# EAGLE design main (EAGLE 5.12)

## Sheet 1 of 4
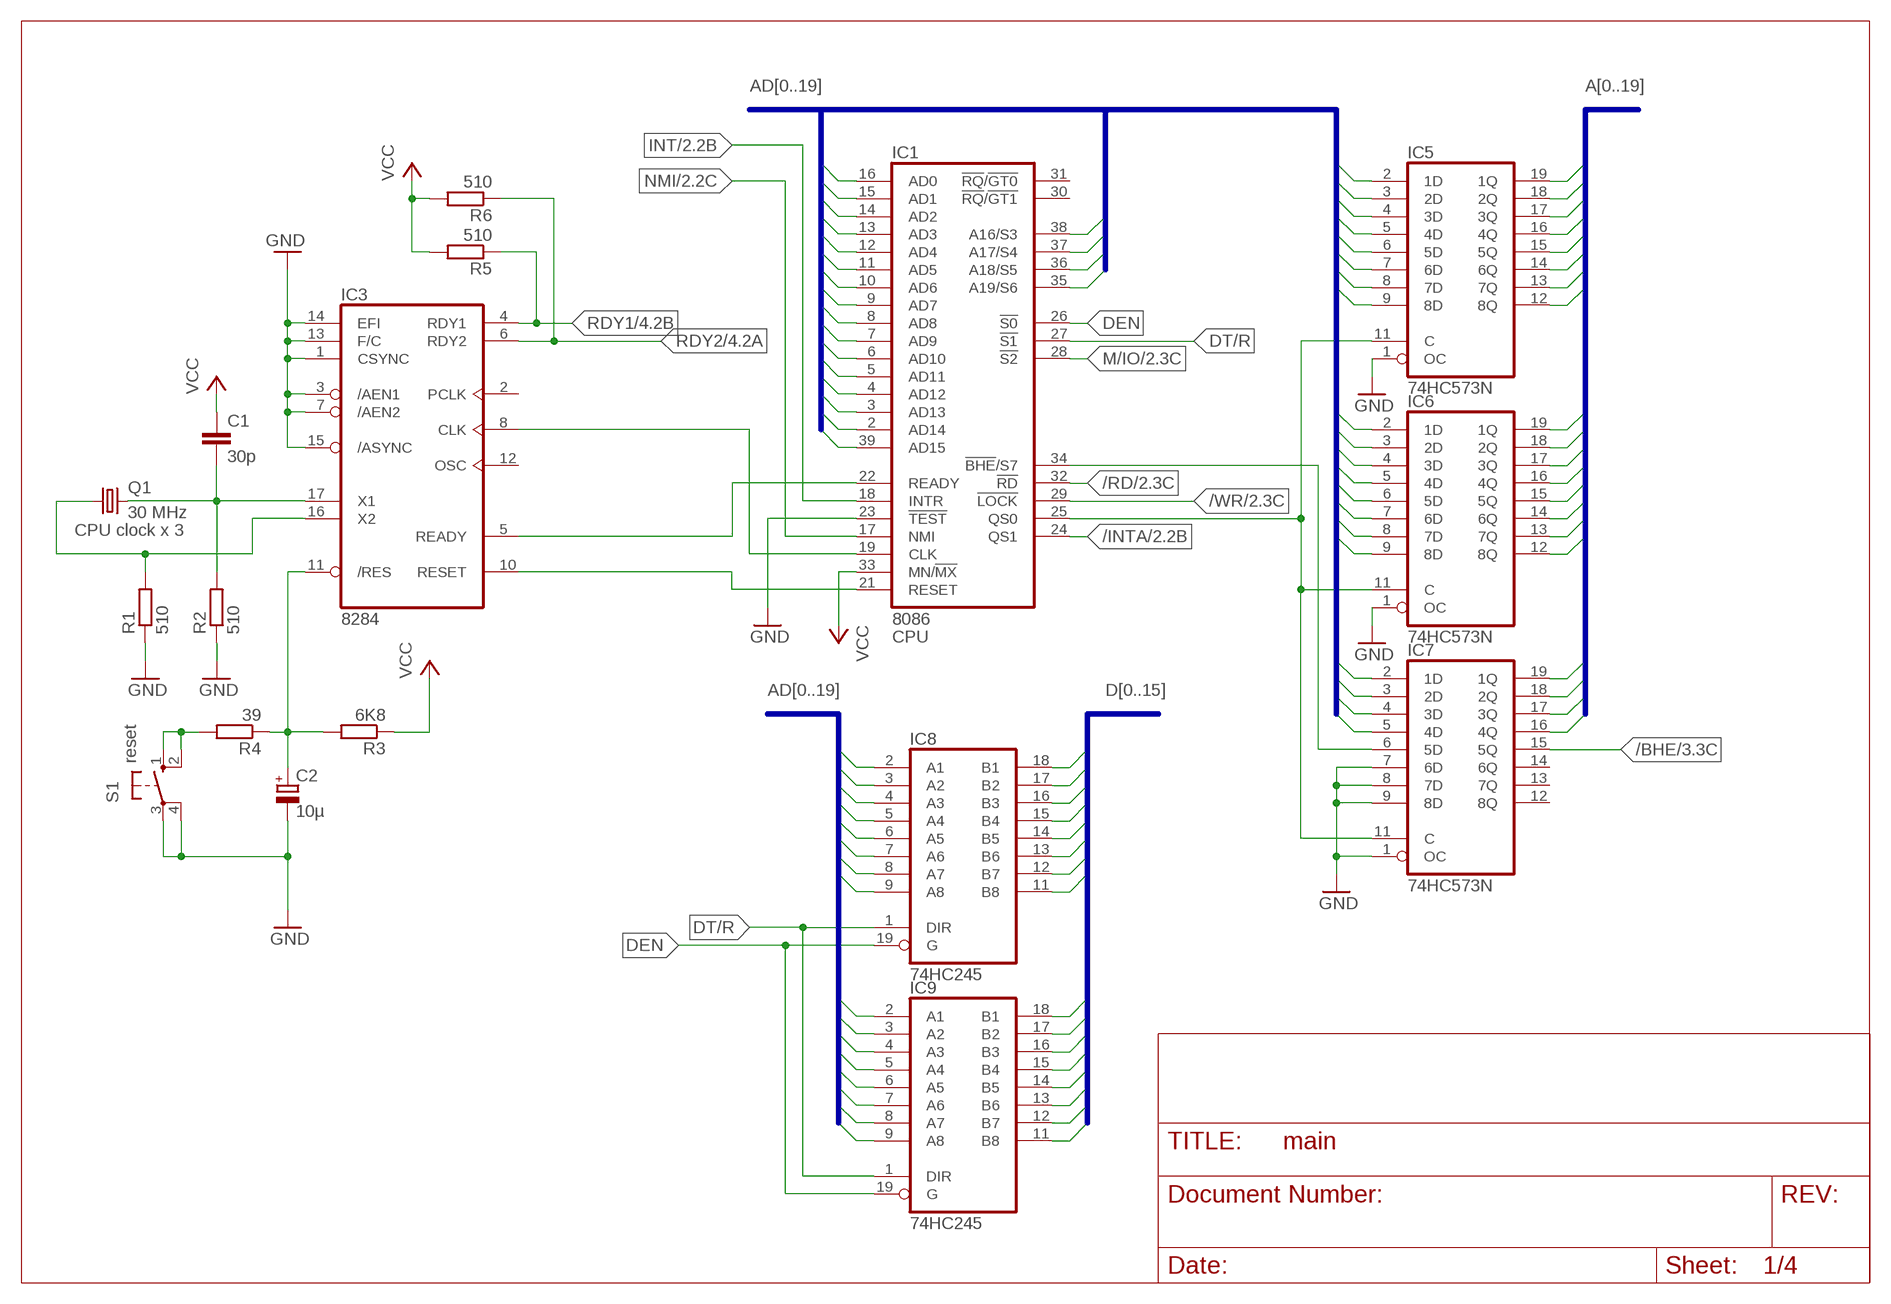
[diagram p0: schematic, sheet 1]

### Parts
C1  30p  C-EU025-024X044  [C025-024X044]
C2  10µ  CPOL-EUE2-4  [E2-4]
IC1  8086  [DIL40]
IC3  8284  [DIL18]
IC5  74HC573N  [DIL20]
IC6  74HC573N  [DIL20]
IC7  74HC573N  [DIL20]
IC8  74HC245  74LS245N  [DIL20]
IC9  74HC245  74LS245N  [DIL20]
Q1  30 MHz  CRYSTALHC49S  [HC49/S]
R1  510  R-EU_0207/7  [0207/7]
R2  510  R-EU_0207/7  [0207/7]
R3  6K8  R-EU_0207/7  [0207/7]
R4  39  R-EU_0207/7  [0207/7]
R5  510  R-EU_0207/7  [0207/7]
R6  510  R-EU_0207/7  [0207/7]
S1  reset  10-XX  [B3F-10XX]

### Nets
/BHE: IC7.15(5Q) ; also sheet 3,4
/BHE_S7: IC1.34(!BHE!/S7) IC7.6(5D)
/INTA: IC1.24(QS1) ; also sheet 2
/RD: IC1.32(!RD) ; also sheet 2,4
/WR: IC1.29(!LOCK) ; also sheet 2,4
A0: IC5.19(1Q) ; also sheet 3,4
A1: IC5.18(2Q) ; also sheet 2,3,4
A2: IC5.17(3Q) ; also sheet 2,3,4
A3: IC5.16(4Q) ; also sheet 2,3,4
A4: IC5.15(5Q) ; also sheet 2,3,4
A5: IC5.14(6Q) ; also sheet 2,3,4
A6: IC5.13(7Q) ; also sheet 2,3,4
A7: IC5.12(8Q) ; also sheet 2,3,4
A8: IC6.19(1Q) ; also sheet 2,3,4
A9: IC6.18(2Q) ; also sheet 2,3,4
A10: IC6.17(3Q) ; also sheet 3,4
A11: IC6.16(4Q) ; also sheet 3,4
A12: IC6.15(5Q) ; also sheet 3,4
A13: IC6.14(6Q) ; also sheet 3,4
A14: IC6.13(7Q) ; also sheet 3,4
A15: IC6.12(8Q) ; also sheet 3,4
A16: IC7.19(1Q) ; also sheet 2,3,4
A17: IC7.18(2Q) ; also sheet 2,4
A18: IC7.17(3Q) ; also sheet 2,4
A19: IC7.16(4Q) ; also sheet 2,4
AD0: IC1.16(AD0) IC5.2(1D) IC8.2(A1)
AD1: IC1.15(AD1) IC5.3(2D) IC8.3(A2)
AD2: IC1.14(AD2) IC5.4(3D) IC8.4(A3)
AD3: IC1.13(AD3) IC5.5(4D) IC8.5(A4)
AD4: IC1.12(AD4) IC5.6(5D) IC8.6(A5)
AD5: IC1.11(AD5) IC5.7(6D) IC8.7(A6)
AD6: IC1.10(AD6) IC5.8(7D) IC8.8(A7)
AD7: IC1.9(AD7) IC5.9(8D) IC8.9(A8)
AD8: IC1.8(AD8) IC6.2(1D) IC9.2(A1)
AD9: IC1.7(AD9) IC6.3(2D) IC9.3(A2)
AD10: IC1.6(AD10) IC6.4(3D) IC9.4(A3)
AD11: IC1.5(AD11) IC6.5(4D) IC9.5(A4)
AD12: IC1.4(AD12) IC6.6(5D) IC9.6(A5)
AD13: IC1.3(AD13) IC6.7(6D) IC9.7(A6)
AD14: IC1.2(AD14) IC6.8(7D) IC9.8(A7)
AD15: IC1.39(AD15) IC6.9(8D) IC9.9(A8)
AD16: IC1.38(A16/S3) IC7.2(1D)
AD17: IC1.37(A17/S4) IC7.3(2D)
AD18: IC1.36(A18/S5) IC7.4(3D)
AD19: IC1.35(A19/S6) IC7.5(4D)
ALE: IC1.25(QS0) IC5.11(C) IC6.11(C) IC7.11(C)
CLK: IC1.19(CLK) IC3.8(CLK)
D0: IC8.18(B1) ; also sheet 2,3,4
D1: IC8.17(B2) ; also sheet 2,3,4
D2: IC8.16(B3) ; also sheet 2,3,4
D3: IC8.15(B4) ; also sheet 2,3,4
D4: IC8.14(B5) ; also sheet 2,3,4
D5: IC8.13(B6) ; also sheet 2,3,4
D6: IC8.12(B7) ; also sheet 2,3,4
D7: IC8.11(B8) ; also sheet 2,3,4
D8: IC9.18(B1) ; also sheet 3,4
D9: IC9.17(B2) ; also sheet 3,4
D10: IC9.16(B3) ; also sheet 3,4
D11: IC9.15(B4) ; also sheet 3,4
D12: IC9.14(B5) ; also sheet 3,4
D13: IC9.13(B6) ; also sheet 3,4
D14: IC9.12(B7) ; also sheet 3,4
D15: IC9.11(B8) ; also sheet 3,4
DEN: IC1.26(!S0) IC8.19(G) IC9.19(G)
DT/R: IC1.27(!S1) IC8.1(DIR) IC9.1(DIR)
GND: C2.- IC1.23(!TEST) IC3.1(CSYNC) IC3.3(/AEN1) IC3.7(/AEN2) IC3.13(F/C) IC3.14(EFI) IC3.15(/ASYNC) IC5.1(OC) IC6.1(OC) IC7.1(OC) IC7.7(6D) IC7.8(7D) IC7.9(8D) R1.1 R2.1 S1.3(P) S1.4(P1) ; also sheet 2,4
INT: IC1.18(INTR) ; also sheet 2
M/IO: IC1.28(!S2) ; also sheet 2,4
N$4: C2.+ IC3.11(/RES) R3.2 R4.1
N$6: C1.2 IC3.17(X1) Q1.2 R2.2
N$7: IC3.16(X2) Q1.1 R1.2
N$9: R4.2 S1.1(S) S1.2(S1)
NMI: IC1.17(NMI) ; also sheet 2
RDY1: IC3.4(RDY1) R5.1 ; also sheet 4
RDY2: IC3.6(RDY2) R6.1 ; also sheet 4
READY: IC1.22(READY) IC3.5(READY)
RESET: IC1.21(RESET) IC3.10(RESET) ; also sheet 4
VCC: C1.1 IC1.33(MN/!MX) R3.1 R5.2 R6.2 ; also sheet 2,4
Unconnected: IC1.30(!RQ!/!GT1) IC1.31(!RQ!/!GT0) IC3.2(PCLK) IC3.12(OSC) IC7.12(8Q) IC7.13(7Q) IC7.14(6Q)

### Buses
AD[0..19]
A[0..19]
D[0..15]

### Notes on the sheet
- CPU clock x 3
- CPU

## Sheet 2 of 4
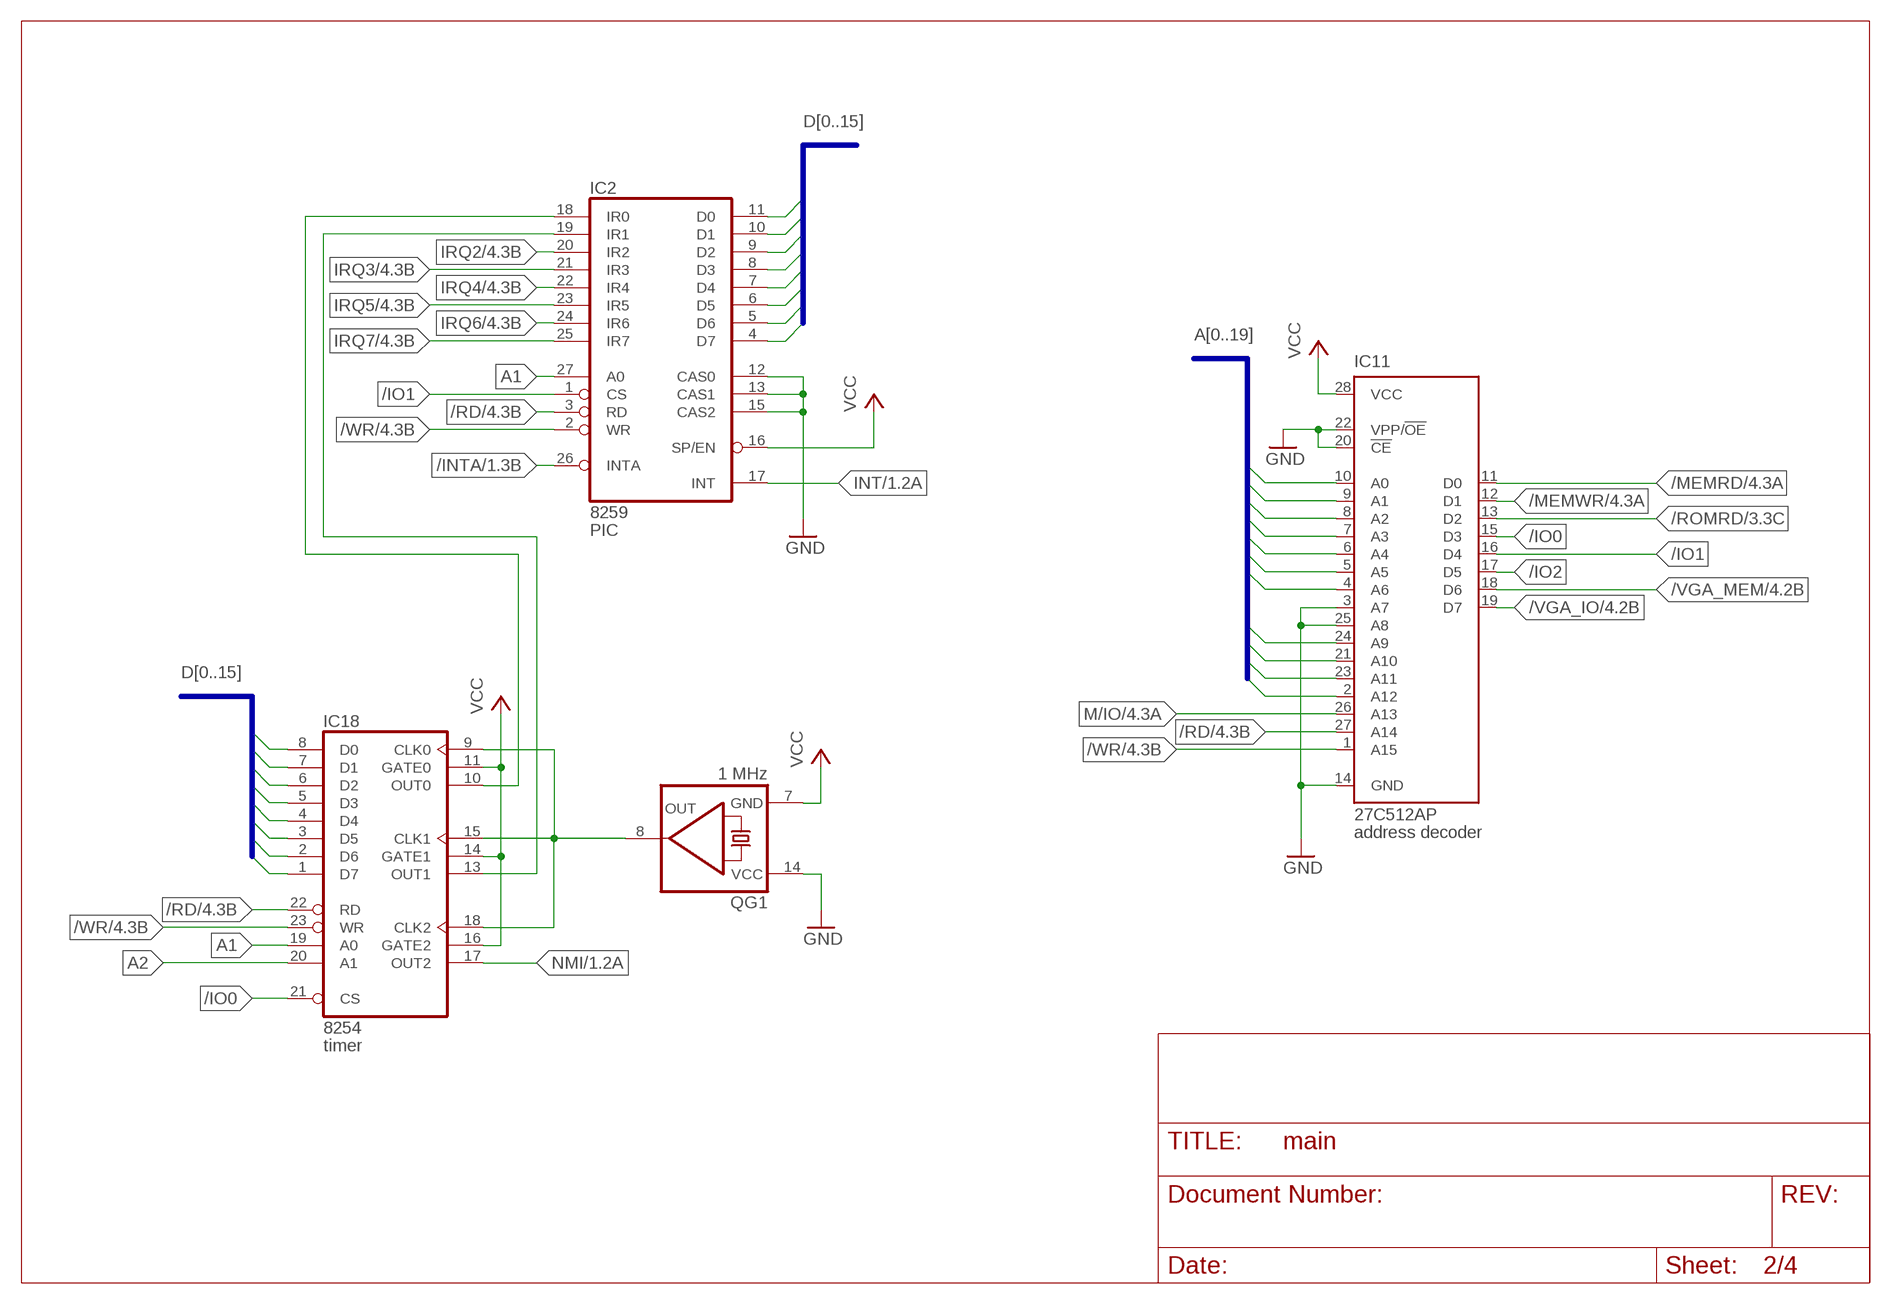
[diagram p1: schematic, sheet 2]

### Parts
IC2  8259  8259A  [DIL28-6]
IC11  27C512AP  [DIL28-6]
IC18  8254  8253  [DIL24-6]
QG1  1 MHz  QG5860  [DIL14S]

### Nets
/INTA: IC2.26(INTA) ; also sheet 1
/IO0: IC11.15(D3) IC18.21(CS)
/IO1: IC2.1(CS) IC11.16(D4)
/IO2: IC11.17(D5)
/MEMRD: IC11.11(D0) ; also sheet 4
/MEMWR: IC11.12(D1) ; also sheet 4
/RD: IC2.3(RD) IC11.27(A14) IC18.22(RD) ; also sheet 1,4
/ROMRD: IC11.13(D2) ; also sheet 3
/VGA_IO: IC11.19(D7) ; also sheet 4
/VGA_MEM: IC11.18(D6) ; also sheet 4
/WR: IC2.2(WR) IC11.1(A15) IC18.23(WR) ; also sheet 1,4
A1: IC2.27(A0) IC18.19(A0) ; also sheet 1,3,4
A2: IC18.20(A1) ; also sheet 1,3,4
A3: IC11.10(A0) ; also sheet 1,3,4
A4: IC11.9(A1) ; also sheet 1,3,4
A5: IC11.8(A2) ; also sheet 1,3,4
A6: IC11.7(A3) ; also sheet 1,3,4
A7: IC11.6(A4) ; also sheet 1,3,4
A8: IC11.5(A5) ; also sheet 1,3,4
A9: IC11.4(A6) ; also sheet 1,3,4
A16: IC11.24(A9) ; also sheet 1,3,4
A17: IC11.21(A10) ; also sheet 1,4
A18: IC11.23(A11) ; also sheet 1,4
A19: IC11.2(A12) ; also sheet 1,4
D0: IC2.11(D0) IC18.8(D0) ; also sheet 1,3,4
D1: IC2.10(D1) IC18.7(D1) ; also sheet 1,3,4
D2: IC2.9(D2) IC18.6(D2) ; also sheet 1,3,4
D3: IC2.8(D3) IC18.5(D3) ; also sheet 1,3,4
D4: IC2.7(D4) IC18.4(D4) ; also sheet 1,3,4
D5: IC2.6(D5) IC18.3(D5) ; also sheet 1,3,4
D6: IC2.5(D6) IC18.2(D6) ; also sheet 1,3,4
D7: IC2.4(D7) IC18.1(D7) ; also sheet 1,3,4
GND: IC2.12(CAS0) IC2.13(CAS1) IC2.15(CAS2) IC11.3(A7) IC11.14(GND) IC11.20(!CE) IC11.22(VPP/!OE) IC11.25(A8) QG1.14(VCC) ; also sheet 1,4
INT: IC2.17(INT) ; also sheet 1
IRQ0: IC2.18(IR0) IC18.10(OUT0)
IRQ1: IC2.19(IR1) IC18.13(OUT1)
IRQ2: IC2.20(IR2) ; also sheet 4
IRQ3: IC2.21(IR3) ; also sheet 4
IRQ4: IC2.22(IR4) ; also sheet 4
IRQ5: IC2.23(IR5) ; also sheet 4
IRQ6: IC2.24(IR6) ; also sheet 4
IRQ7: IC2.25(IR7) ; also sheet 4
M/IO: IC11.26(A13) ; also sheet 1,4
N$1: IC18.9(CLK0) IC18.15(CLK1) IC18.18(CLK2) QG1.8(OUT)
NMI: IC18.17(OUT2) ; also sheet 1
VCC: IC2.16(SP/EN) IC11.28(VCC) IC18.11(GATE0) IC18.14(GATE1) IC18.16(GATE2) QG1.7(GND) ; also sheet 1,4

### Buses
D[0..15]
A[0..19]

### Notes on the sheet
- PIC
- address decoder
- timer

## Sheet 3 of 4
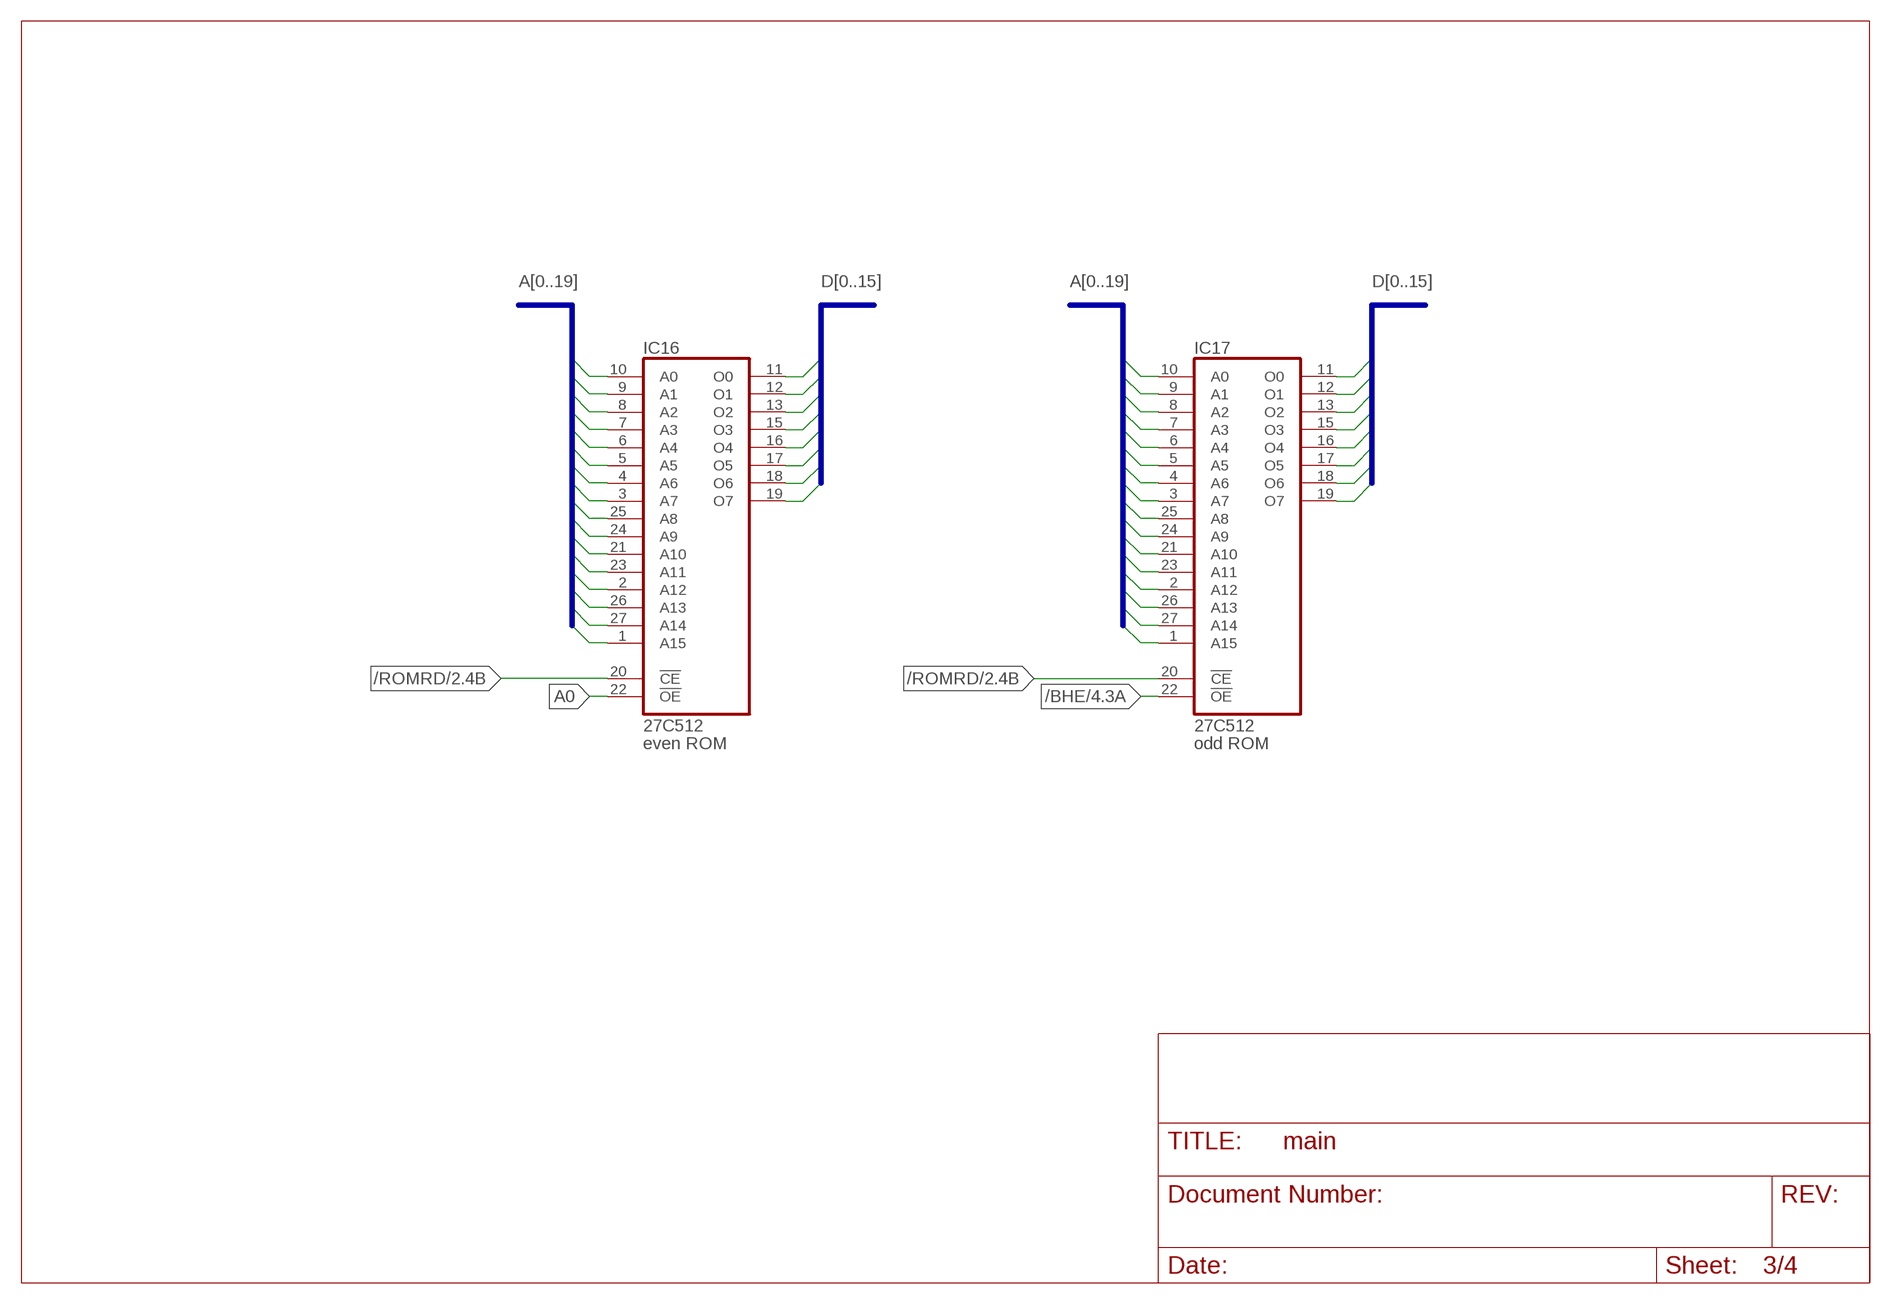
[diagram p2: schematic, sheet 3]

### Parts
IC16  27C512  27512  [DIL28]
IC17  27C512  27512  [DIL28]

### Nets
/BHE: IC17.22(!OE) ; also sheet 1,4
/ROMRD: IC16.20(!CE) IC17.20(!CE) ; also sheet 2
A0: IC16.22(!OE) ; also sheet 1,4
A1: IC16.10(A0) IC17.10(A0) ; also sheet 1,2,4
A2: IC16.9(A1) IC17.9(A1) ; also sheet 1,2,4
A3: IC16.8(A2) IC17.8(A2) ; also sheet 1,2,4
A4: IC16.7(A3) IC17.7(A3) ; also sheet 1,2,4
A5: IC16.6(A4) IC17.6(A4) ; also sheet 1,2,4
A6: IC16.5(A5) IC17.5(A5) ; also sheet 1,2,4
A7: IC16.4(A6) IC17.4(A6) ; also sheet 1,2,4
A8: IC16.3(A7) IC17.3(A7) ; also sheet 1,2,4
A9: IC16.25(A8) IC17.25(A8) ; also sheet 1,2,4
A10: IC16.24(A9) IC17.24(A9) ; also sheet 1,4
A11: IC16.21(A10) IC17.21(A10) ; also sheet 1,4
A12: IC16.23(A11) IC17.23(A11) ; also sheet 1,4
A13: IC16.2(A12) IC17.2(A12) ; also sheet 1,4
A14: IC16.26(A13) IC17.26(A13) ; also sheet 1,4
A15: IC16.27(A14) IC17.27(A14) ; also sheet 1,4
A16: IC16.1(A15) IC17.1(A15) ; also sheet 1,2,4
D0: IC16.11(O0) ; also sheet 1,2,4
D1: IC16.12(O1) ; also sheet 1,2,4
D2: IC16.13(O2) ; also sheet 1,2,4
D3: IC16.15(O3) ; also sheet 1,2,4
D4: IC16.16(O4) ; also sheet 1,2,4
D5: IC16.17(O5) ; also sheet 1,2,4
D6: IC16.18(O6) ; also sheet 1,2,4
D7: IC16.19(O7) ; also sheet 1,2,4
D8: IC17.11(O0) ; also sheet 1,4
D9: IC17.12(O1) ; also sheet 1,4
D10: IC17.13(O2) ; also sheet 1,4
D11: IC17.15(O3) ; also sheet 1,4
D12: IC17.16(O4) ; also sheet 1,4
D13: IC17.17(O5) ; also sheet 1,4
D14: IC17.18(O6) ; also sheet 1,4
D15: IC17.19(O7) ; also sheet 1,4

### Buses
D[0..15]
A[0..19]

### Notes on the sheet
- even ROM | odd ROM

## Sheet 4 of 4
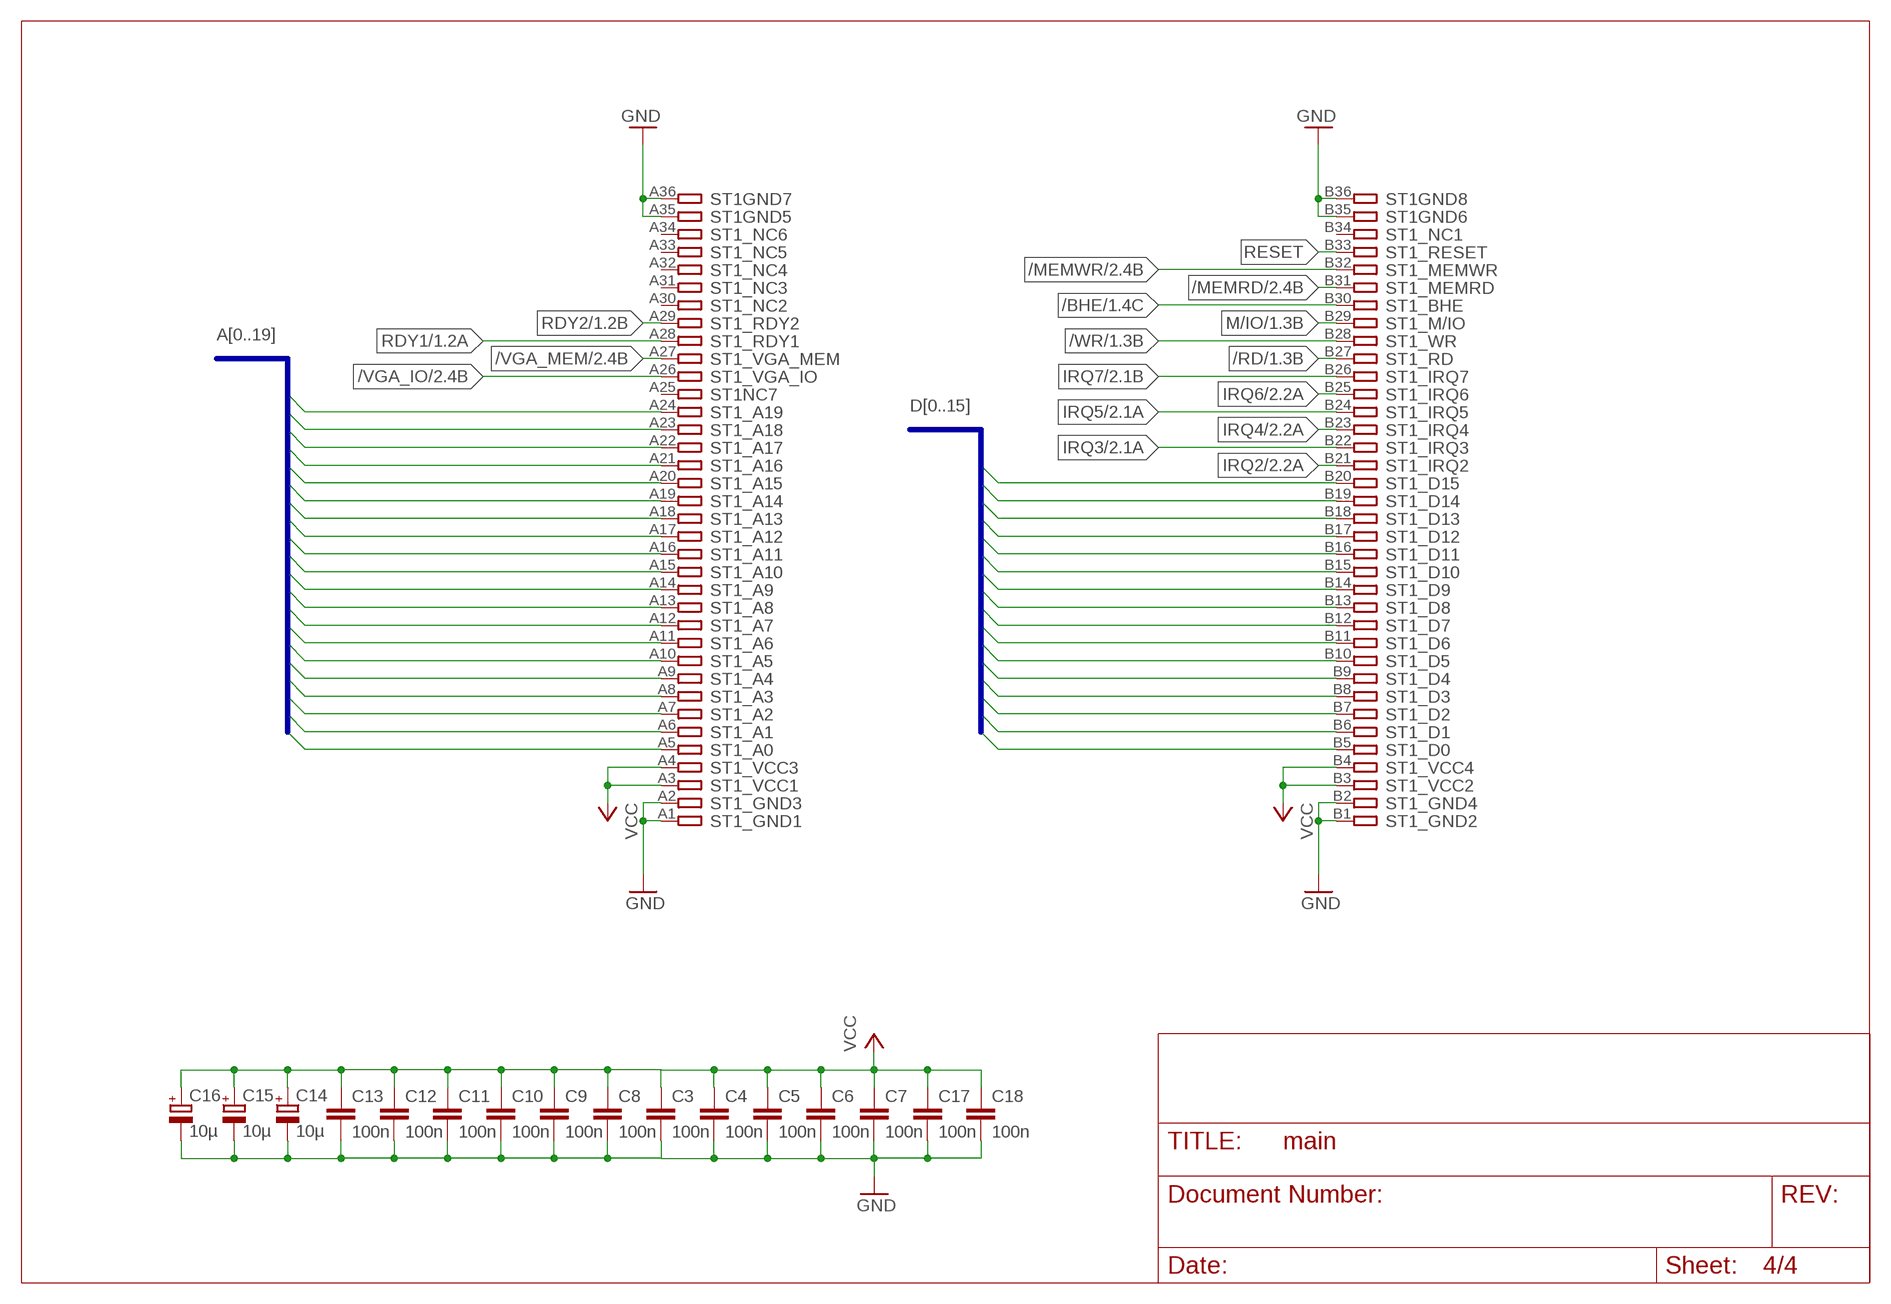
[diagram p3: schematic, sheet 4]

### Parts
C3  100n  C-EU050-024X044  [C050-024X044]
C4  100n  C-EU050-024X044  [C050-024X044]
C5  100n  C-EU050-024X044  [C050-024X044]
C6  100n  C-EU050-024X044  [C050-024X044]
C7  100n  C-EU050-024X044  [C050-024X044]
C8  100n  C-EU050-024X044  [C050-024X044]
C9  100n  C-EU050-024X044  [C050-024X044]
C10  100n  C-EU050-024X044  [C050-024X044]
C11  100n  C-EU050-024X044  [C050-024X044]
C12  100n  C-EU050-024X044  [C050-024X044]
C13  100n  C-EU050-024X044  [C050-024X044]
C14  10µ  CPOL-EUE2-4  [E2-4]
C15  10µ  CPOL-EUE2-4  [E2-4]
C16  10µ  CPOL-EUE2-4  [E2-4]
C17  100n  C-EU050-024X044  [C050-024X044]
C18  100n  C-EU050-024X044  [C050-024X044]
ST1  MINI8086_EDGE  [MINI8086_CON]

### Nets
/BHE: ST1.B30 ; also sheet 1,3
/MEMRD: ST1.B31 ; also sheet 2
/MEMWR: ST1.B32 ; also sheet 2
/RD: ST1.B27 ; also sheet 1,2
/VGA_IO: ST1.A26 ; also sheet 2
/VGA_MEM: ST1.A27 ; also sheet 2
/WR: ST1.B28 ; also sheet 1,2
A0: ST1.A5 ; also sheet 1,3
A1: ST1.A6 ; also sheet 1,2,3
A2: ST1.A7 ; also sheet 1,2,3
A3: ST1.A8 ; also sheet 1,2,3
A4: ST1.A9 ; also sheet 1,2,3
A5: ST1.A10 ; also sheet 1,2,3
A6: ST1.A11 ; also sheet 1,2,3
A7: ST1.A12 ; also sheet 1,2,3
A8: ST1.A13 ; also sheet 1,2,3
A9: ST1.A14 ; also sheet 1,2,3
A10: ST1.A15 ; also sheet 1,3
A11: ST1.A16 ; also sheet 1,3
A12: ST1.A17 ; also sheet 1,3
A13: ST1.A18 ; also sheet 1,3
A14: ST1.A19 ; also sheet 1,3
A15: ST1.A20 ; also sheet 1,3
A16: ST1.A21 ; also sheet 1,2,3
A17: ST1.A22 ; also sheet 1,2
A18: ST1.A23 ; also sheet 1,2
A19: ST1.A24 ; also sheet 1,2
D0: ST1.B5 ; also sheet 1,2,3
D1: ST1.B6 ; also sheet 1,2,3
D2: ST1.B7 ; also sheet 1,2,3
D3: ST1.B8 ; also sheet 1,2,3
D4: ST1.B9 ; also sheet 1,2,3
D5: ST1.B10 ; also sheet 1,2,3
D6: ST1.B11 ; also sheet 1,2,3
D7: ST1.B12 ; also sheet 1,2,3
D8: ST1.B13 ; also sheet 1,3
D9: ST1.B14 ; also sheet 1,3
D10: ST1.B15 ; also sheet 1,3
D11: ST1.B16 ; also sheet 1,3
D12: ST1.B17 ; also sheet 1,3
D13: ST1.B18 ; also sheet 1,3
D14: ST1.B19 ; also sheet 1,3
D15: ST1.B20 ; also sheet 1,3
GND: C3.2 C4.2 C5.2 C6.2 C7.2 C8.2 C9.2 C10.2 C11.2 C12.2 C13.2 C14.- C15.- C16.- C17.2 C18.2 ST1.A1 ST1.A2 ST1.A35 ST1.A36 ST1.B1 ST1.B2 ST1.B35 ST1.B36 ; also sheet 1,2
IRQ2: ST1.B21 ; also sheet 2
IRQ3: ST1.B22 ; also sheet 2
IRQ4: ST1.B23 ; also sheet 2
IRQ5: ST1.B24 ; also sheet 2
IRQ6: ST1.B25 ; also sheet 2
IRQ7: ST1.B26 ; also sheet 2
M/IO: ST1.B29 ; also sheet 1,2
RDY1: ST1.A28 ; also sheet 1
RDY2: ST1.A29 ; also sheet 1
RESET: ST1.B33 ; also sheet 1
VCC: C3.1 C4.1 C5.1 C6.1 C7.1 C8.1 C9.1 C10.1 C11.1 C12.1 C13.1 C14.+ C15.+ C16.+ C17.1 C18.1 ST1.A3 ST1.A4 ST1.B3 ST1.B4 ; also sheet 1,2
Unconnected: ST1.A25 ST1.A30 ST1.A31 ST1.A32 ST1.A33 ST1.A34 ST1.B34

### Buses
D[0..15]
A[0..19]

## Power pins joined to a net without a drawn wire
GND: IC1.1(GND) IC1.20(GND) IC2.14(GND) IC3.9(GND) IC5.10(GND) IC6.10(GND) IC7.10(GND) IC8.10(GND) IC9.10(GND) IC16.14(GND) IC17.14(GND) IC18.12(GND)
VCC: IC1.40(VCC) IC2.28(VCC) IC3.18(VCC) IC5.20(VCC) IC6.20(VCC) IC7.20(VCC) IC8.20(VCC) IC9.20(VCC) IC16.28(VCC) IC17.28(VCC) IC18.24(VCC)

## Library data of the parts
C1 C3-C13 C17 C18 = rcl:C-EU: CAPACITOR, European symbol
C2 C14-C16 = rcl:CPOL-EU: POLARIZED CAPACITOR, European symbol
IC1 = micro-siemens:8086: MICROPROCESSOR/PERIPHERAL DEVICE; OC_FARNELL: unknown; OC_NEWARK: unknown
IC2 = micro-intel:8259A: MICROCOMPUTER/PERIPHERAL DEVICE; OC_FARNELL: unknown; OC_NEWARK: unknown
IC3 = micro-intel:8284: MICROCOMPUTER/PERIPHERAL DEVICE; OC_FARNELL: unknown; OC_NEWARK: unknown
IC5-IC7 = 74xx-eu:74*573: 8-bit D latch BUS DRIVER
IC8 IC9 = 74xx-us:74*245: Octal BUS TRANSCEIVER, 3-state
IC11 = microchip:27*512A: CMOS EPROM 512 K (64 K x 8); MPN: M27C512-90B6; OC_FARNELL: 1642690; OC_NEWARK: 20M6389
IC16 IC17 = memory:27512: MEMORY
IC18 = micro-intel:8253: MICROCOMPUTER/PERIPHERAL DEVICE; OC_FARNELL: unknown; OC_NEWARK: unknown
Q1 = crystal:CRYSTAL: CRYSTAL; OC_FARNELL: 1667008; OC_NEWARK: unknown
QG1 = crystal:QG5860: CRYSTAL RESONATOR; OC_FARNELL: unknown; OC_NEWARK: unknown
R1-R6 = rcl:R-EU_: RESISTOR, European symbol
S1 = switch-omron:10-XX: OMRON SWITCH; MPN: B3F-1000; OC_FARNELL: 176432; OC_NEWARK: 36M3542
ST1 = con-mini8086:MINI8086_EDGE: Mini8086 slot connector

## Board
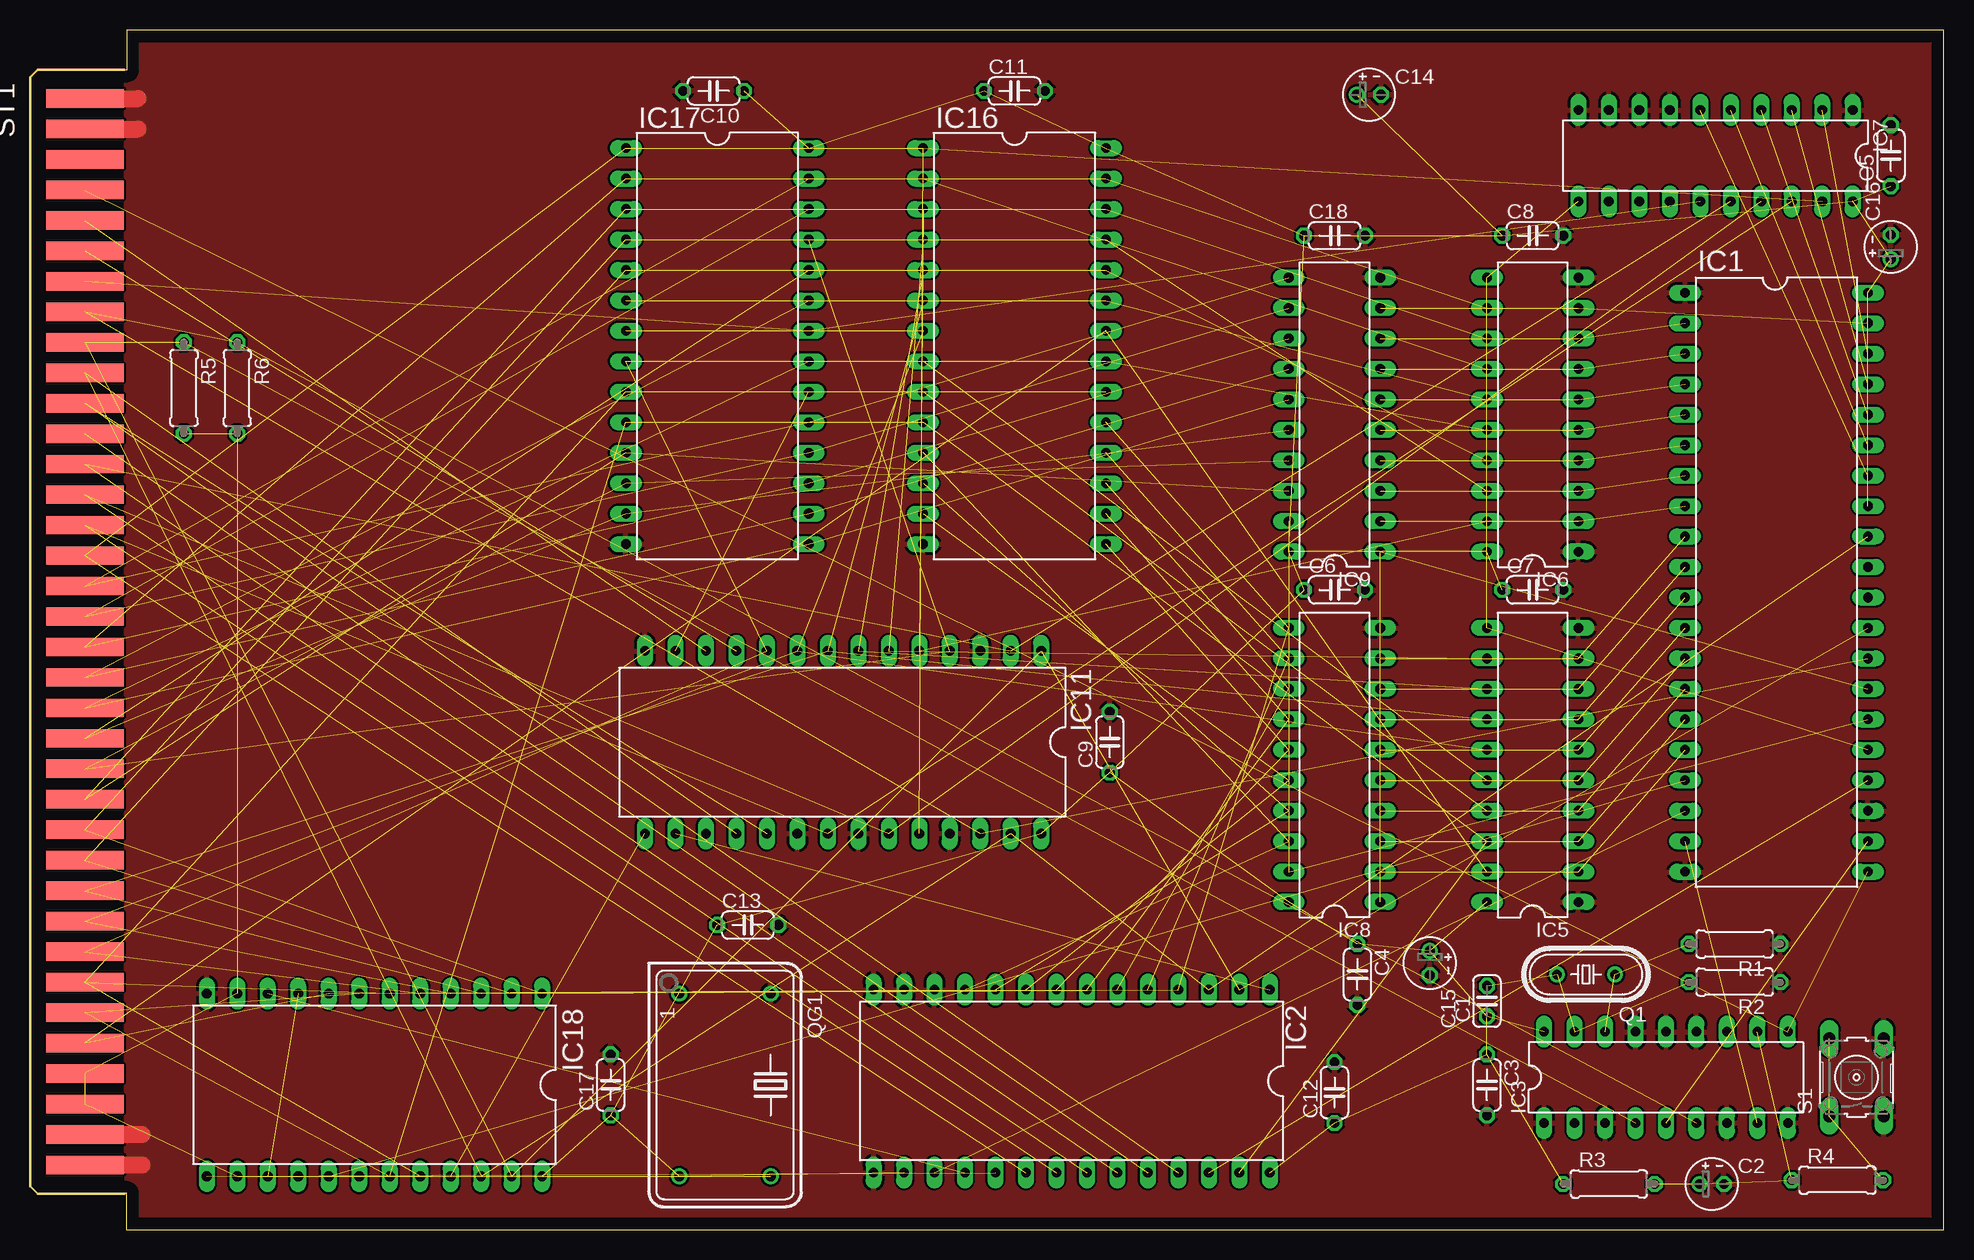
[diagram p4: board, top side]
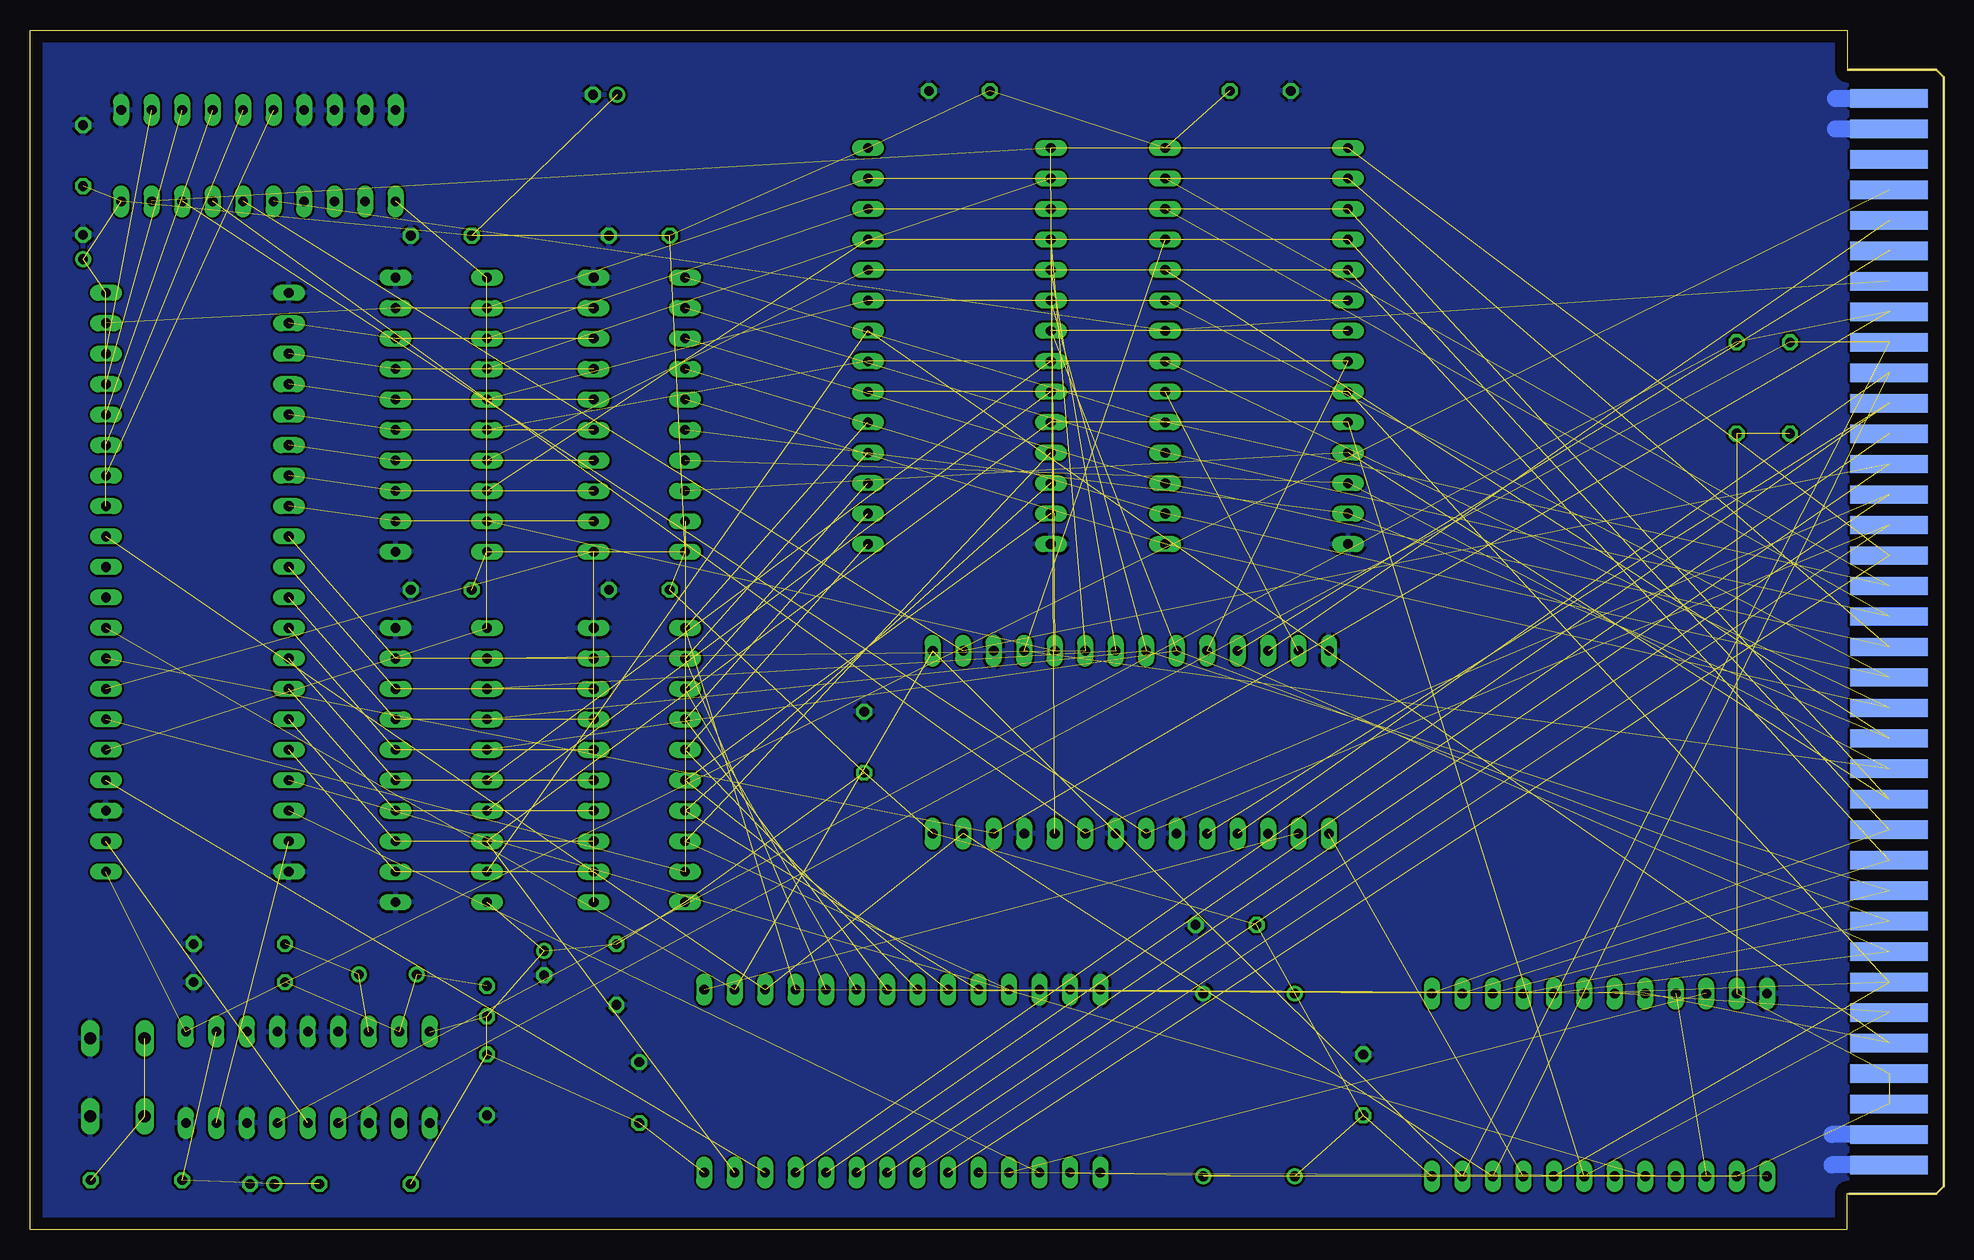
[diagram p5: board, bottom side, seen from below]

Size 159.49 x 100.01 mm. Coordinates in mm from the lower left corner, seen from the top.
Outline: 8.06,100 159.49,100 159.49,0 8.06,0 8.06,3.02 7.91,3.02
Outline: 8.06,100.01 8.06,96.68 7.91,96.68
Copper layers (1*16): Top 0.035mm / dielectric 1.5mm / Bottom 0.035mm
Design rules "default *": minimum track width 10mil, minimum drill 0.3mm, track to track 8mil, track to pad 8mil, pad to pad 8mil, via to via 8mil, smd to smd 8mil, copper to edge 40mil, drill to drill 8mil, minimum pad ring 10mil, minimum via ring 8mil, stop-mask expansion 4mil, vias tented up to drill 0mil, thermal gap 10mil

### Footprints (pad centres in the part's own frame; a part is rotated, then mirrored left to right if it is on the bottom)
C025-024X044 = drill 0.813 octagon: 1 -1.27,0; 2 1.27,0
E2-4 = drill 0.813 pad 1.27 round: + -1.016,0 | drill 0.813 pad 1.27 octagon: - 1.016,0
C050-024X044 = drill 0.813 octagon: 1 -2.54,0; 2 2.54,0
DIL40 = drill 0.813 long: 1 -24.13,-7.62; 2 -21.59,-7.62; 3 -19.05,-7.62; 4 -16.51,-7.62; 5 -13.97,-7.62; 6 -11.43,-7.62; 7 -8.89,-7.62; 8 -6.35,-7.62; 9 -3.81,-7.62; 10 -1.27,-7.62; 11 1.27,-7.62; 12 3.81,-7.62; 13 6.35,-7.62; 14 8.89,-7.62; 15 11.43,-7.62; 16 13.97,-7.62; 17 16.51,-7.62; 18 19.05,-7.62; 19 21.59,-7.62; 20 24.13,-7.62; 21 24.13,7.62; 22 21.59,7.62; 23 19.05,7.62; 24 16.51,7.62; 25 13.97,7.62; 26 11.43,7.62; 27 8.89,7.62; 28 6.35,7.62; 29 3.81,7.62; 30 1.27,7.62; 31 -1.27,7.62; 32 -3.81,7.62; 33 -6.35,7.62; 34 -8.89,7.62; 35 -11.43,7.62; 36 -13.97,7.62; 37 -16.51,7.62; 38 -19.05,7.62; 39 -21.59,7.62; 40 -24.13,7.62
DIL28-6 = drill 0.813 long: 1 -16.51,-7.62; 2 -13.97,-7.62; 3 -11.43,-7.62; 4 -8.89,-7.62; 5 -6.35,-7.62; 6 -3.81,-7.62; 7 -1.27,-7.62; 8 1.27,-7.62; 9 3.81,-7.62; 10 6.35,-7.62; 11 8.89,-7.62; 12 11.43,-7.62; 13 13.97,-7.62; 14 16.51,-7.62; 15 16.51,7.62; 16 13.97,7.62; 17 11.43,7.62; 18 8.89,7.62; 19 6.35,7.62; 20 3.81,7.62; 21 1.27,7.62; 22 -1.27,7.62; 23 -3.81,7.62; 24 -6.35,7.62; 25 -8.89,7.62; 26 -11.43,7.62; 27 -13.97,7.62; 28 -16.51,7.62
DIL18 = drill 0.813 long: 1 -10.16,-3.81; 2 -7.62,-3.81; 3 -5.08,-3.81; 4 -2.54,-3.81; 5 0,-3.81; 6 2.54,-3.81; 7 5.08,-3.81; 8 7.62,-3.81; 9 10.16,-3.81; 10 10.16,3.81; 11 7.62,3.81; 12 5.08,3.81; 13 2.54,3.81; 14 0,3.81; 15 -2.54,3.81; 16 -5.08,3.81; 17 -7.62,3.81; 18 -10.16,3.81
DIL20 = drill 0.813 long: 1 -11.43,-3.81; 2 -8.89,-3.81; 3 -6.35,-3.81; 4 -3.81,-3.81; 5 -1.27,-3.81; 6 1.27,-3.81; 7 3.81,-3.81; 8 6.35,-3.81; 9 8.89,-3.81; 10 11.43,-3.81; 11 11.43,3.81; 12 8.89,3.81; 13 6.35,3.81; 14 3.81,3.81; 15 1.27,3.81; 16 -1.27,3.81; 17 -3.81,3.81; 18 -6.35,3.81; 19 -8.89,3.81; 20 -11.43,3.81
DIL28 = drill 0.813 long: 1 -16.51,-7.62; 2 -13.97,-7.62; 3 -11.43,-7.62; 4 -8.89,-7.62; 5 -6.35,-7.62; 6 -3.81,-7.62; 7 -1.27,-7.62; 8 1.27,-7.62; 9 3.81,-7.62; 10 6.35,-7.62; 11 8.89,-7.62; 12 11.43,-7.62; 13 13.97,-7.62; 14 16.51,-7.62; 15 16.51,7.62; 16 13.97,7.62; 17 11.43,7.62; 18 8.89,7.62; 19 6.35,7.62; 20 3.81,7.62; 21 1.27,7.62; 22 -1.27,7.62; 23 -3.81,7.62; 24 -6.35,7.62; 25 -8.89,7.62; 26 -11.43,7.62; 27 -13.97,7.62; 28 -16.51,7.62
DIL24-6 = drill 0.813 long: 1 -13.97,-7.62; 2 -11.43,-7.62; 3 -8.89,-7.62; 4 -6.35,-7.62; 5 -3.81,-7.62; 6 -1.27,-7.62; 7 1.27,-7.62; 8 3.81,-7.62; 9 6.35,-7.62; 10 8.89,-7.62; 11 11.43,-7.62; 12 13.97,-7.62; 13 13.97,7.62; 14 11.43,7.62; 15 8.89,7.62; 16 6.35,7.62; 17 3.81,7.62; 18 1.27,7.62; 19 -1.27,7.62; 20 -3.81,7.62; 21 -6.35,7.62; 22 -8.89,7.62; 23 -11.43,7.62; 24 -13.97,7.62
HC49/S = drill 0.813 round: 1 -2.413,0; 2 2.413,0
DIL14S = drill 0.813 round: 1 -7.62,-3.81; 7 7.62,-3.81; 8 7.62,3.81; 14 -7.62,3.81
0207/7 = drill 0.813 octagon: 1 -3.81,0; 2 3.81,0
B3F-10XX = drill 1.016 long: 1 -3.251,2.261; 2 3.251,2.261; 3 -3.251,-2.261; 4 3.251,-2.261
MINI8086_CON = smd 1.524 x 6.477: A1 -5.08,5.08; A2 -7.62,5.08; A3 -10.16,5.08; A4 -12.7,5.08; A5 -15.24,5.08; A6 -17.78,5.08; A7 -20.32,5.08; A8 -22.86,5.08; A9 -25.4,5.08; A10 -27.94,5.08; A11 -30.48,5.08; A12 -33.02,5.08; A13 -35.56,5.08; A14 -38.1,5.08; A15 -40.64,5.08; A16 -43.18,5.08; A17 -45.72,5.08; A18 -48.26,5.08; A19 -50.8,5.08; A20 -53.34,5.08; A21 -55.88,5.08; A22 -58.42,5.08; A23 -60.96,5.08; A24 -63.5,5.08; A25 -66.04,5.08; A26 -68.58,5.08; A27 -71.12,5.08; A28 -73.66,5.08; A29 -76.2,5.08; A30 -78.74,5.08; A31 -81.28,5.08; A32 -83.82,5.08; A33 -86.36,5.08; A34 -88.9,5.08; A35 -91.44,5.08; A36 -93.98,5.08 | smd 1.524 x 6.477 bottom: B1 -5.08,5.08; B2 -7.62,5.08; B3 -10.16,5.08; B4 -12.7,5.08; B5 -15.24,5.08; B6 -17.78,5.08; B7 -20.32,5.08; B8 -22.86,5.08; B9 -25.4,5.08; B10 -27.94,5.08; B11 -30.48,5.08; B12 -33.02,5.08; B13 -35.56,5.08; B14 -38.1,5.08; B15 -40.64,5.08; B16 -43.18,5.08; B17 -45.72,5.08; B18 -48.26,5.08; B19 -50.8,5.08; B20 -53.34,5.08; B21 -55.88,5.08; B22 -58.42,5.08; B23 -60.96,5.08; B24 -63.5,5.08; B25 -66.04,5.08; B26 -68.58,5.08; B27 -71.12,5.08; B28 -73.66,5.08; B29 -76.2,5.08; B30 -78.74,5.08; B31 -81.28,5.08; B32 -83.82,5.08; B33 -86.36,5.08; B34 -88.9,5.08; B35 -91.44,5.08; B36 -93.98,5.08

### Placement (x,y rotation side)
C1  121.41,19.05 90 top
C2  140.14,3.81 0 top
C3  121.41,12.06 270 top
C4  110.62,21.27 270 top
C5  155.07,89.53 90 top
C6  108.71,53.34 0 top
C7  125.22,53.34 0 top
C8  125.22,82.87 0 top
C9  89.98,40.64 90 top
C10  56.96,94.93 180 top
C11  82.04,94.93 0 top
C12  108.71,11.43 90 top
C13  59.82,25.4 0 top
C14  111.57,94.61 0 top
C15  116.65,22.23 270 top
C16  155.07,81.92 90 top
C17  48.39,12.06 90 top
C18  108.71,82.87 0 top
IC1  145.54,53.98 270 top
IC2  86.8,12.38 180 top
IC3  136.33,12.7 0 top
IC5  125.22,38.73 90 top
IC6  125.22,67.94 90 top
IC7  140.46,89.53 180 top
IC8  108.71,38.73 90 top
IC9  108.71,67.94 90 top
IC11  67.75,40.64 180 top
IC16  82.04,73.66 270 top
IC17  57.28,73.66 270 top
IC18  28.7,12.06 180 top
Q1  129.67,21.27 180 top
QG1  57.91,12.06 270 top
R1  142.05,23.81 180 top
R2  142.05,20.64 180 top
R3  131.57,3.81 0 top
R4  150.62,4.13 0 top
R5  12.83,70.17 270 top
R6  17.27,70.17 270 top
S1  152.21,12.7 90 top
ST1  -0.51,0.32 270 top

### Tracks (layer width: path | path; a pad name or v marks a point on that pad's centre or on a via)
/BHE  (2 unrouted)
/BHE_S7  (1 unrouted)
/INTA  (1 unrouted)
/IO0  (1 unrouted)
/IO1  (1 unrouted)
/MEMRD  (1 unrouted)
/MEMWR  (1 unrouted)
/RD  (4 unrouted)
/ROMRD  (2 unrouted)
/VGA_IO  (1 unrouted)
/VGA_MEM  (1 unrouted)
/WR  (4 unrouted)
A0  (2 unrouted)
A1  (5 unrouted)
A2  (4 unrouted)
A3  (4 unrouted)
A4  (4 unrouted)
A5  (4 unrouted)
A6  (4 unrouted)
A7  (4 unrouted)
A8  (4 unrouted)
A9  (4 unrouted)
A10  (3 unrouted)
A11  (3 unrouted)
A12  (3 unrouted)
A13  (3 unrouted)
A14  (3 unrouted)
A15  (3 unrouted)
A16  (4 unrouted)
A17  (2 unrouted)
A18  (2 unrouted)
A19  (2 unrouted)
AD0  (2 unrouted)
AD1  (2 unrouted)
AD2  (2 unrouted)
AD3  (2 unrouted)
AD4  (2 unrouted)
AD5  (2 unrouted)
AD6  (2 unrouted)
AD7  (2 unrouted)
AD8  (2 unrouted)
AD9  (2 unrouted)
AD10  (2 unrouted)
AD11  (2 unrouted)
AD12  (2 unrouted)
AD13  (2 unrouted)
AD14  (2 unrouted)
AD15  (2 unrouted)
AD16  (1 unrouted)
AD17  (1 unrouted)
AD18  (1 unrouted)
AD19  (1 unrouted)
ALE  (3 unrouted)
CLK  (1 unrouted)
D0  (4 unrouted)
D1  (4 unrouted)
D2  (4 unrouted)
D3  (4 unrouted)
D4  (4 unrouted)
D5  (4 unrouted)
D6  (4 unrouted)
D7  (4 unrouted)
D8  (2 unrouted)
D9  (2 unrouted)
D10  (2 unrouted)
D11  (2 unrouted)
D12  (2 unrouted)
D13  (2 unrouted)
D14  (2 unrouted)
D15  (2 unrouted)
DEN  (2 unrouted)
DT/R  (2 unrouted)
GND
  Top 1.422: ST1.B36 9.02,94.3 | ST1.B35 9.02,91.76 | ST1.A1 9.33,5.4 | ST1.A2 9.33,7.94
  Bottom 1.422: ST1.B36 9.02,94.3 | ST1.B35 9.02,91.76 | ST1.A1 9.33,5.4 | ST1.A2 9.33,7.94
  pour Bottom: 8.06,100.33 159.51,100.33 159.51,0 8.06,0
  pour Top: 8.06,100.33 159.51,100.33 159.51,0 8.06,0
INT  (1 unrouted)
IRQ0  (1 unrouted)
IRQ1  (1 unrouted)
IRQ2  (1 unrouted)
IRQ3  (1 unrouted)
IRQ4  (1 unrouted)
IRQ5  (1 unrouted)
IRQ6  (1 unrouted)
IRQ7  (1 unrouted)
M/IO  (2 unrouted)
N$1  (3 unrouted)
N$4  (3 unrouted)
N$6  (3 unrouted)
N$7  (2 unrouted)
N$9  (2 unrouted)
NMI  (1 unrouted)
RDY1  (2 unrouted)
RDY2  (2 unrouted)
READY  (1 unrouted)
RESET  (2 unrouted)
VCC  (41 unrouted)